# Altium schematic sheet 3.3V.schdoc
size 327 x 139 mm; SheetNumber: 1; SheetTotal: 1
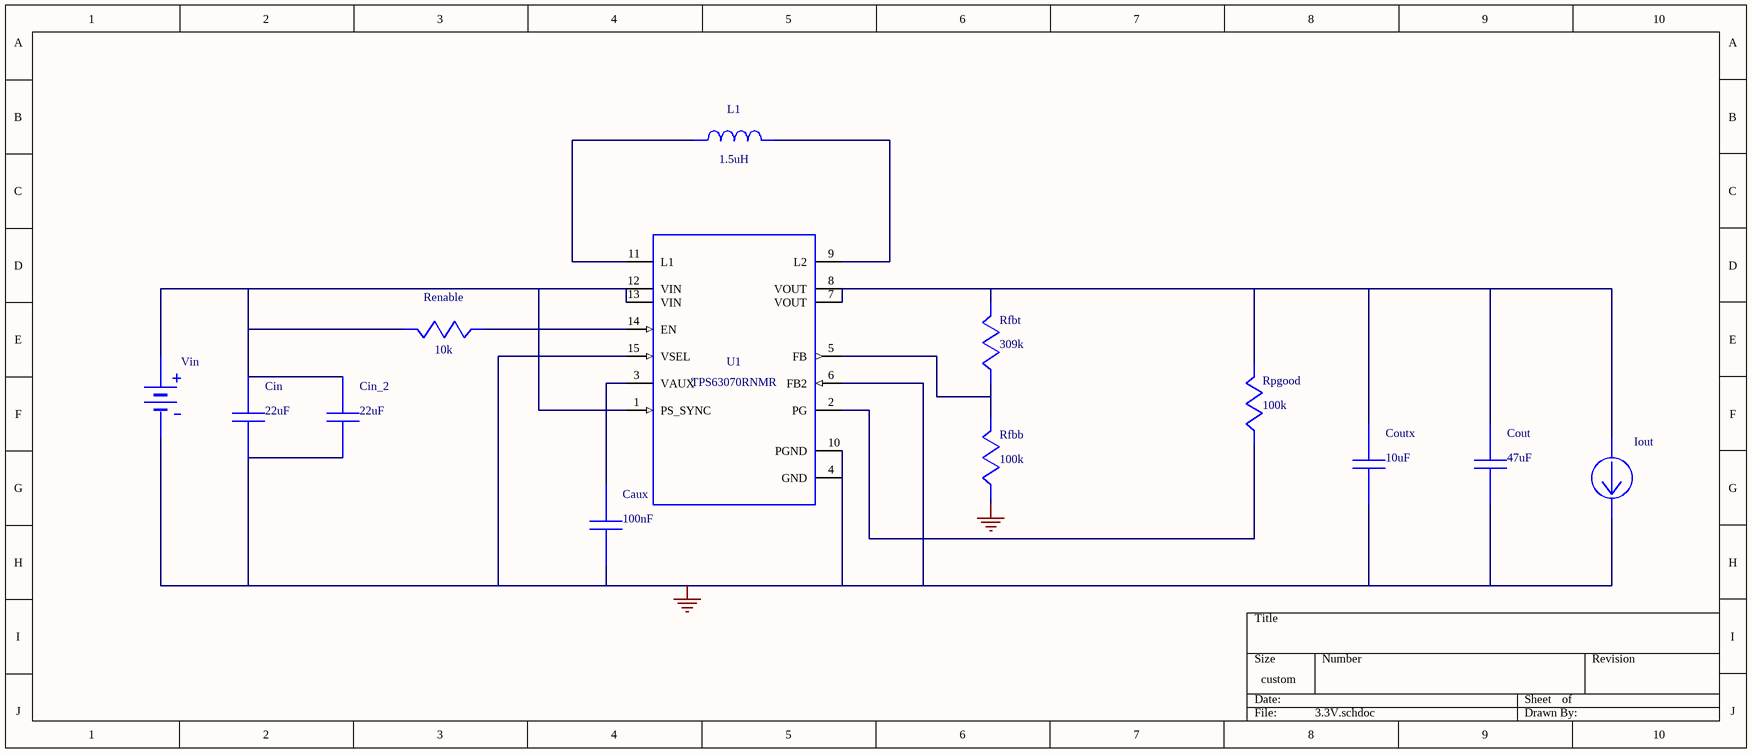
[diagram p0: 3.3V.schdoc]

## Parts
Caux  value 100nF  (hidden comment: GRM155R71C104KA88D)
Cin  value 22uF  (hidden comment: C3216X5R1V226M160AC)
Cin_2  value 22uF  (hidden comment: C3216X5R1V226M160AC)
Cout  value 47uF  (hidden comment: GRM31CC80J476KE18L)
Coutx  value 10uF  (hidden comment: GRM188R60J106ME47D)
Iout  WB_CURRENT_LOAD  (value not drawn)
L1  value 1.5uH  (hidden comment: 'SPM4012T-1R5M')
Renable  value 10k  (hidden comment: RC0201FR-0710KL)
Rfbb  value 100k  (hidden comment: CRCW0603100KFKEA)
Rfbt  value 309k  (hidden comment: RC0603FR-07309KL)
Rpgood  value 100k  (hidden comment: CRCW0603100KFKEA)
U1  TPS63070RNMR
Vin  WB_BATTERY  (value not drawn)

## Nets
0: Caux.2 Cin.2 Cin_2.2 Cout.2 Coutx.2 Iout.2(-) Rfbb.2 U1.4(GND) U1.6(FB2) U1.10(PGND) U1.15(VSEL) Vin.2(-)
NetCaux_1: Caux.1 U1.3(VAUX)
NetCin_1: Cin.1 Cin_2.1 Renable.1 U1.1(PS_SYNC) U1.12(VIN) U1.13(VIN) Vin.1(+)
NetCout_1: Cout.1 Coutx.1 Iout.1(+) Rfbt.1 Rpgood.1 U1.7(VOUT) U1.8(VOUT)
NetL1_1: L1.1 U1.9(L2)
NetL1_2: L1.2 U1.11(L1)
NetRenable_2: Renable.2 U1.14(EN)
NetRfbb_1: Rfbb.1 Rfbt.2 U1.5(FB)
NetRpgood_2: Rpgood.2 U1.2(PG)

## Library data of the parts
Caux = GRM155R71C104KA88D: GRM155R71C104KA8; Manufacturer Name: MuRata; PackageReference: GRM155R71C104KA88D; Manufacturer Part Number: GRM155R71C104KA88D
Cin Cin_2 = C3216X5R1V226M160AC: C3216X5R1V226M16; Manufacturer Name: TDK; PackageReference: C3216X5R1V226M160AC; Manufacturer Part Number: C3216X5R1V226M160AC
Cout = GRM31CC80J476KE18L: GRM31CC80J476KE1; Manufacturer Name: MuRata; PackageReference: GRM31CC80J476KE18L; Manufacturer Part Number: GRM31CC80J476KE18L
Coutx = GRM188R60J106ME47D: GRM188R60J106ME4; Manufacturer Name: MuRata; PackageReference: GRM188R60J106ME47D; Manufacturer Part Number: GRM188R60J106ME47D
L1 = 'SPM4012T-1R5M': SPM4012T-1R5M; Manufacturer Name: TDK; PackageReference: SPM4012T-1R5M; Manufacturer Part Number: 'SPM4012T-1R5M'
Renable = RC0201FR-0710KL: Manufacturer Name: Yageo; PackageReference: RC0201FR-0710KL; Manufacturer Part Number: RC0201FR-0710KL
Rfbb Rpgood = CRCW0603100KFKEA: Manufacturer Name: Vishay-Dale; PackageReference: CRCW0603100KFKEA; Manufacturer Part Number: CRCW0603100KFKEA
Rfbt = RC0603FR-07309KL: Manufacturer Name: Yageo; PackageReference: RC0603FR-07309KL; Manufacturer Part Number: RC0603FR-07309KL
U1 = TPS63070RNMR: Manufacturer Name: Texas Instruments; PackageReference: TPS63070RNMR; Manufacturer Part Number: TPS63070RNMR; Value: N/A
Iout = WB_CURRENT_LOAD: PackageReference: WB_CURRENT_LOAD; Manufacturer Part Number: WB_CURRENT_LOAD; Manufacturer Name: WB_CURRENT_LOAD; Value: N/A
Vin = WB_BATTERY: PackageReference: WB_BATTERY; Manufacturer Part Number: WB_BATTERY; Manufacturer Name: WB_BATTERY; Value: N/A